# EAGLE design carduino-board (EAGLE 6.1)
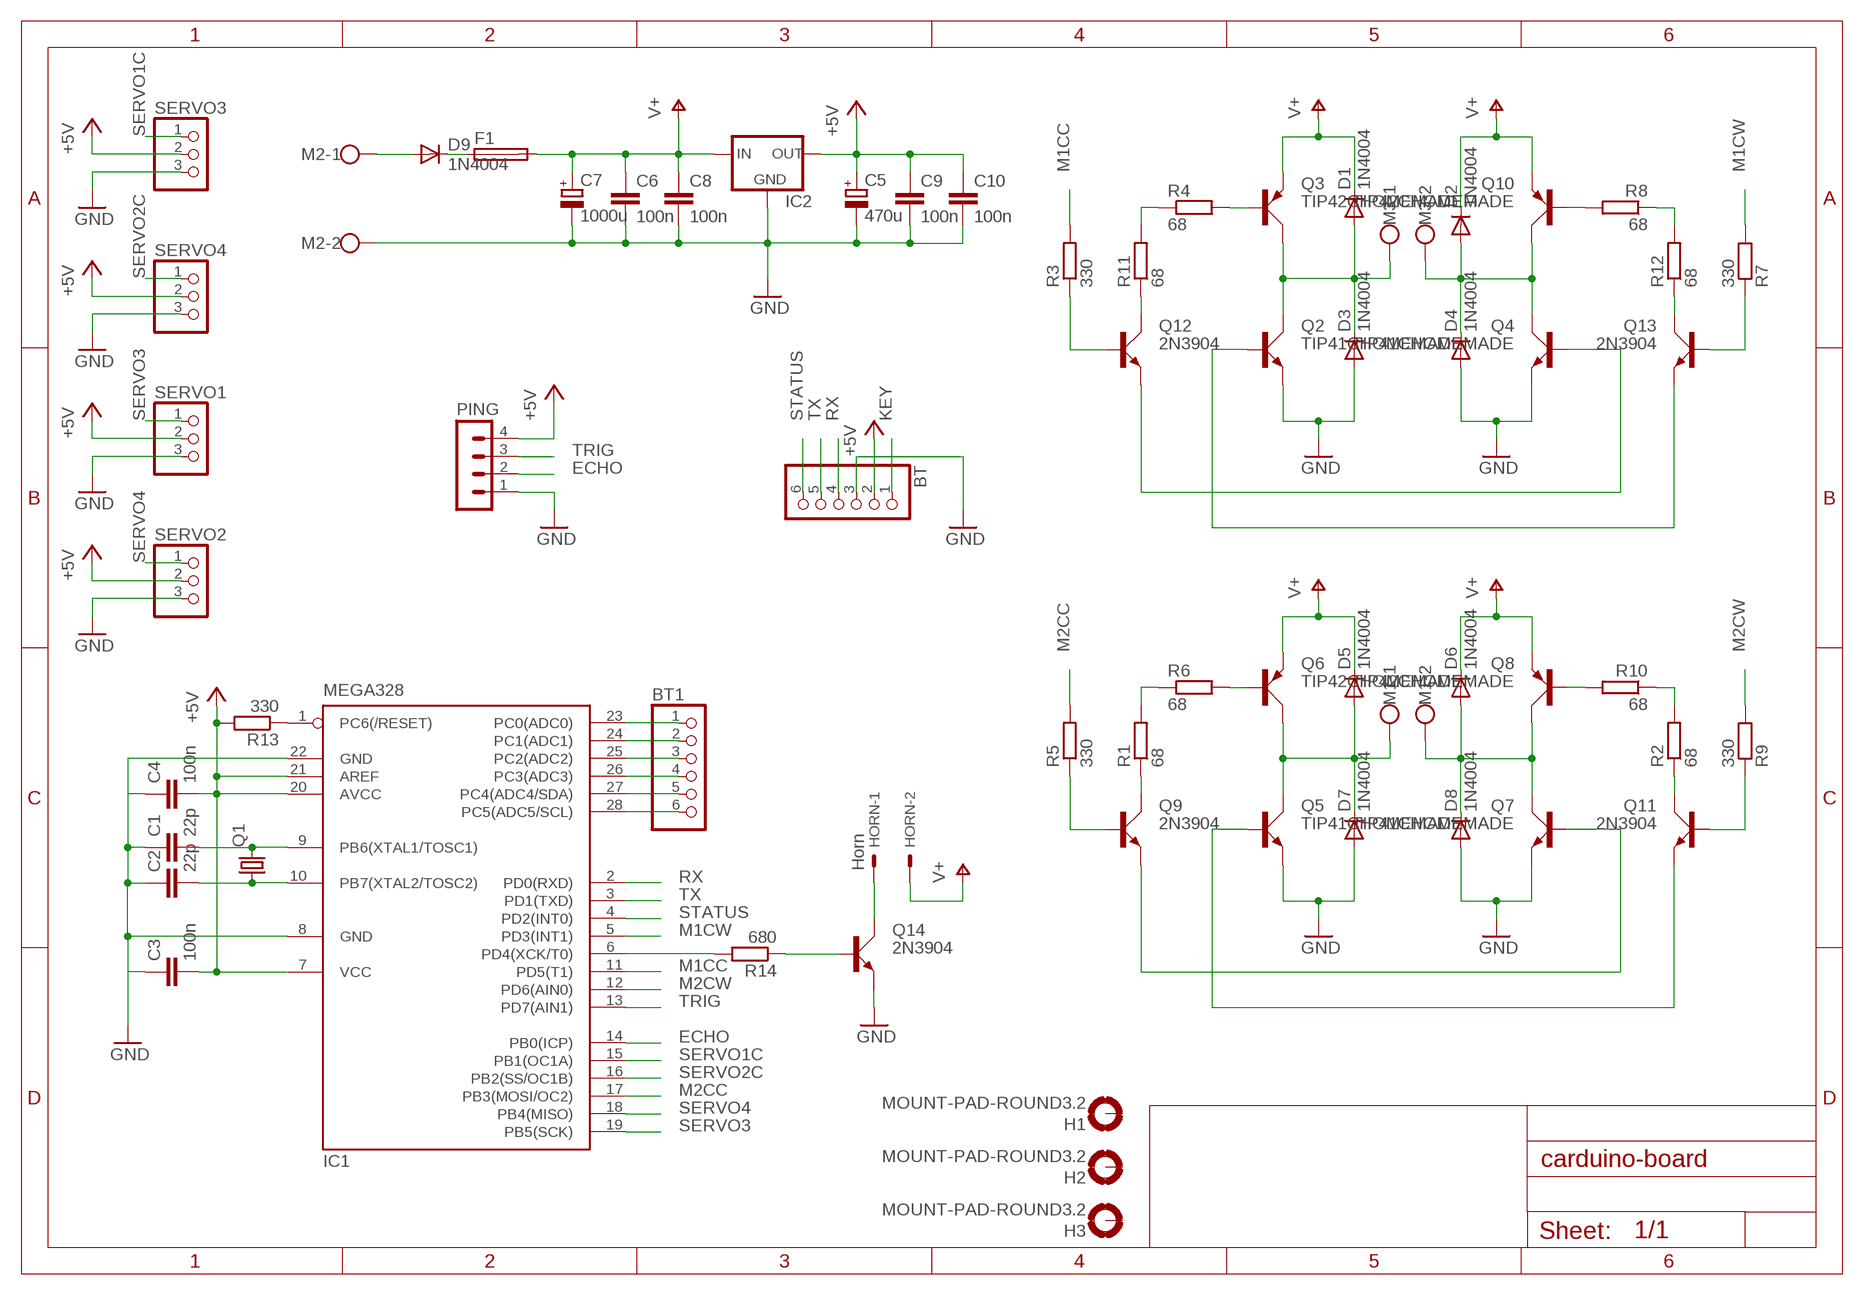
[diagram p0: schematic, sheet 1]

## Parts
BT  PINHD-1X6HOMEMADE  [1X06-HOMEMADE]
BT1  PINHD-1X6HOMEMADE  [1X06-HOMEMADE]
C1  22p  C-EUC1206K  [C1206K]
C2  22p  C-EUC1206K  [C1206K]
C3  100n  C-EUC1206K  [C1206K]
C4  100n  C-EUC1206K  [C1206K]
C5  470u  CPOL-EUUD-8X10  [UD-8X10_NICHICON]
C6  100n  C-EUC1206K  [C1206K]
C7  1000u  CPOL-EUE3.5-10  [E3,5-10]
C8  100n  C-EUC1206K  [C1206K]
C9  100n  C-EUC1206K  [C1206K]
C10  100n  C-EUC1206K  [C1206K]
D1  1N4004  [DO41-10]
D2  1N4004  [DO41-10]
D3  1N4004  [DO41-10]
D4  1N4004  [DO41-10]
D5  1N4004  [DO41-10]
D6  1N4004  [DO41-10]
D7  1N4004  [DO41-10]
D8  1N4004  [DO41-10]
D9  1N4004  [DO41-10]
F1  TE5  [TE5]
H1  MOUNT-PAD-ROUND3.2  [3,2-PAD]
H2  MOUNT-PAD-ROUND3.2  [3,2-PAD]
H3  MOUNT-PAD-ROUND3.2  [3,2-PAD]
HORN  Horn  22-23-2021  [22-23-2021]
IC1  MEGA328  MEGA8-P  [DIL28-3]
IC2  78XXS  [78XXS]
M1  W237-102  [W237-102]
M2  W237-102  [W237-102]
M3  W237-102  [W237-102]
PING  MA04-1HOMEMADE  [MA04-1-HOMEMADE]
Q1  CRYSTALHC49S  [HC49/S]
Q2  TIP41CHOMEMADE  [TO220AV-HOMEMADE]
Q3  TIP42CHOMEMADE  [TO220AV-HOMEMADE]
Q4  TIP41CHOMEMADE  [TO220AV-HOMEMADE]
Q5  TIP41CHOMEMADE  [TO220AV-HOMEMADE]
Q6  TIP42CHOMEMADE  [TO220AV-HOMEMADE]
Q7  TIP41CHOMEMADE  [TO220AV-HOMEMADE]
Q8  TIP42CHOMEMADE  [TO220AV-HOMEMADE]
Q9  2N3904  [TO92D]
Q10  TIP42CHOMEMADE  [TO220AV-HOMEMADE]
Q11  2N3904  [TO92D]
Q12  2N3904  [TO92D]
Q13  2N3904  [TO92D]
Q14  2N3904  [TO92D]
R1  68  R-EU_M1206  [M1206]
R2  68  R-EU_M1206  [M1206]
R3  330  R-EU_M1206  [M1206]
R4  68  R-EU_M1206  [M1206]
R5  330  R-EU_M1206  [M1206]
R6  68  R-EU_M1206  [M1206]
R7  330  R-EU_M1206  [M1206]
R8  68  R-EU_M1206  [M1206]
R9  330  R-EU_M1206  [M1206]
R10  68  R-EU_M1206  [M1206]
R11  68  R-EU_M1206  [M1206]
R12  68  R-EU_M1206  [M1206]
R13  330  R-EU_M1206  [M1206]
R14  680  R-EU_M1206  [M1206]
SERVO1  PINHD-1X3HOMEMADE  [1X03-HOMEMADE]
SERVO2  PINHD-1X3HOMEMADE  [1X03-HOMEMADE]
SERVO3  PINHD-1X3HOMEMADE  [1X03-HOMEMADE]
SERVO4  PINHD-1X3HOMEMADE  [1X03-HOMEMADE]

## Nets
+5V: BT.2 C3.2 C4.2 C5.+ C9.1 C10.1 IC1.7(VCC) IC1.20(AVCC) IC1.21(AREF) IC2.OUT PING.4 R13.2 SERVO1.2 SERVO2.2 SERVO3.2 SERVO4.2
ECHO: IC1.14(PB0(ICP)) PING.2
GND: BT.3 C1.1 C2.1 C3.1 C4.1 C5.- C6.2 C7.- C8.2 C9.2 C10.2 D3.A D4.A D7.A D8.A IC1.8(GND) IC1.22(GND) IC2.GND M2.2 PING.1 Q2.E Q4.E Q5.E Q7.E Q14.E SERVO1.3 SERVO2.3 SERVO3.3 SERVO4.3
KEY: BT.1
M1CC: IC1.11(PD5(T1)) R3.2
M1CW: IC1.5(PD3(INT1)) R7.2
M2CC: IC1.17(PB3(MOSI/OC2)) R5.2
M2CW: IC1.12(PD6(AIN0)) R9.2
N$1: D6.A D8.C M1.2 Q7.C Q8.C
N$2: D5.A D7.C M1.1 Q5.C Q6.C
N$3: Q9.C R1.1
N$4: Q11.C R2.1
N$5: R1.2 R6.1
N$6: R2.2 R10.1
N$7: C1.2 IC1.9(PB6(XTAL1/TOSC1)) Q1.2
N$8: C2.2 IC1.10(PB7(XTAL2/TOSC2)) Q1.1
N$9: Q6.B R6.2
N$10: Q11.B R9.1
N$11: Q7.B Q9.E
N$12: D2.A D4.C M3.2 Q4.C Q10.C
N$13: Q8.B R10.2
N$14: Q5.B Q11.E
N$15: Q9.B R5.1
N$16: D1.A D3.C M3.1 Q2.C Q3.C
N$17: R4.1 R11.2
N$18: Q3.B R4.2
N$19: R8.1 R12.2
N$20: Q10.B R8.2
N$21: Q13.B R7.1
N$22: Q4.B Q12.E
N$23: Q2.B Q13.E
N$24: Q12.B R3.1
N$25: Q12.C R11.1
N$26: Q13.C R12.1
N$27: D9.A M2.1
N$28: D9.C F1.1
N$29: IC1.1(PC6(/RESET)) R13.1
N$30: HORN.1 Q14.C
N$37: Q14.B R14.1
N$38: IC1.6(PD4(XCK/T0)) R14.2
N$39: BT1.1 IC1.23(PC0(ADC0))
N$40: BT1.2 IC1.24(PC1(ADC1))
N$41: BT1.3 IC1.25(PC2(ADC2))
N$42: BT1.4 IC1.26(PC3(ADC3))
N$43: BT1.5 IC1.27(PC4(ADC4/SDA))
N$44: BT1.6 IC1.28(PC5(ADC5/SCL))
RX: BT.4 IC1.2(PD0(RXD))
SERVO1C: IC1.15(PB1(OC1A)) SERVO3.1
SERVO2C: IC1.16(PB2(SS/OC1B)) SERVO4.1
SERVO3: IC1.19(PB5(SCK)) SERVO1.1
SERVO4: IC1.18(PB4(MISO)) SERVO2.1
STATUS: BT.6 IC1.4(PD2(INT0))
TRIG: IC1.13(PD7(AIN1)) PING.3
TX: BT.5 IC1.3(PD1(TXD))
V+: C6.1 C7.+ C8.1 D1.C D2.C D5.C D6.C F1.2 HORN.2 IC2.IN Q3.E Q6.E Q8.E Q10.E
Unconnected: H1.B3,2(MOUNT) H2.B3,2(MOUNT) H3.B3,2(MOUNT)

## Library data of the parts
BT BT1 = adafruit:PINHD-1X6: PIN HEADER
C1-C4 C6 C8-C10 = rcl:C-EU: CAPACITOR, European symbol
C5 C7 = rcl:CPOL-EU: POLARIZED CAPACITOR, European symbol
D1-D9 = adafruit:1N4004: DIODE General purpose 1N400x type rectifier (With bigger pads) http://www.ladyada.net/library/pcb/eaglelibrary.html
F1 = fuse:TE5: FUSE Wickmann; OC_FARNELL: unknown; OC_NEWARK: unknown
H1-H3 = holes:MOUNT-PAD-ROUND: MOUNTING PAD, round
HORN = con-molex:22-23-2021: .100" (2.54mm) Center Header - 2 Pin; MF: MOLEX; MPN: 22-23-2021; OC_FARNELL: 1462926; OC_NEWARK: 25C3832
IC1 = atmel:MEGA8-P: MICROCONTROLLER 8 Kbytes FLASH, 1 kbytes SRAM, 512 bytes EEPROM, USART, 4-channel 10 bit ADC, 2-channel 8 bit ADC Pin compatible with Atmega48, ATMega88, ATMega168 Source: avr.lbr; OC_FARNELL: unknown; OC_NEWARK: unknown
IC2 = v-reg:78XXS: VOLTAGE REGULATOR
M1-M3 = con-wago-500:W237-102: WAGO SCREW CLAMP; MPN: 237-102; OC_FARNELL: unknown; OC_NEWARK: 70K9898
PING = con-lstb:MA04-1: PIN HEADER
Q1 = crystal:CRYSTAL: CRYSTAL; OC_FARNELL: 1667008; OC_NEWARK: unknown
Q2 Q4 Q5 Q7 = transistor-power:TIP41C: NPN TRANSISTOR
Q3 Q6 Q8 Q10 = transistor-power:TIP42C: PNP TRANSISTOR
Q9 Q11-Q14 = transistor-small-signal:2N3904: NPN TRANSISTOR
R1-R14 = rcl:R-EU_: RESISTOR, European symbol
SERVO1-SERVO4 = adafruit:PINHD-1X3: PIN HEADER

## Board
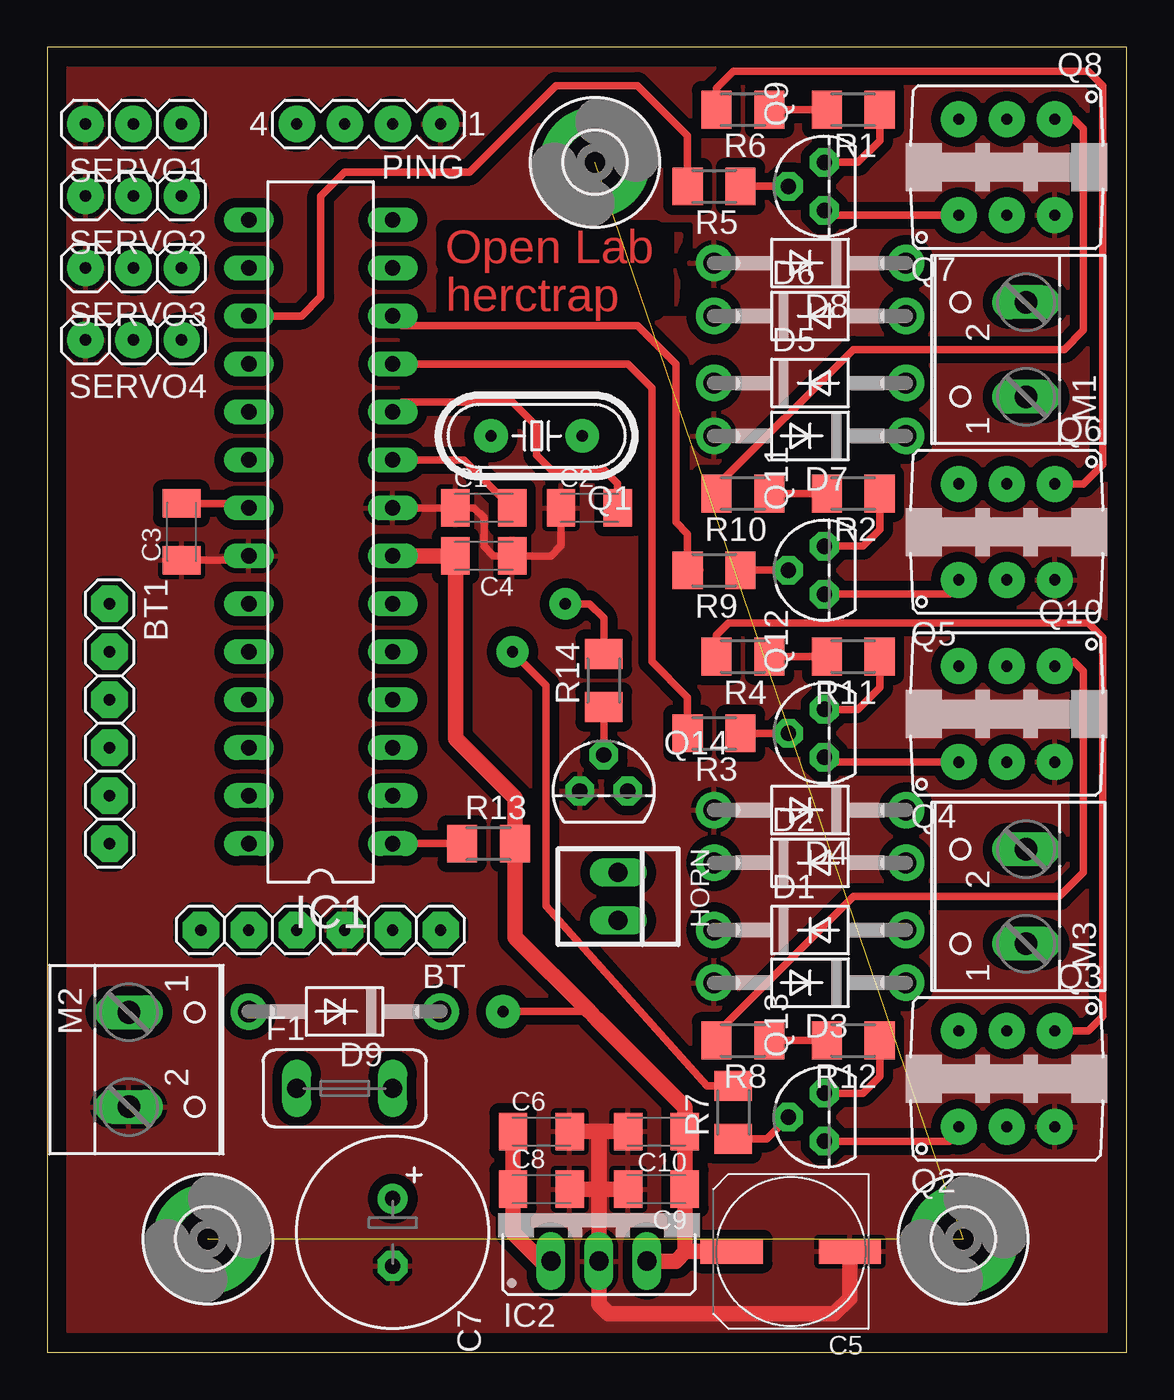
[diagram p1: board, top side]
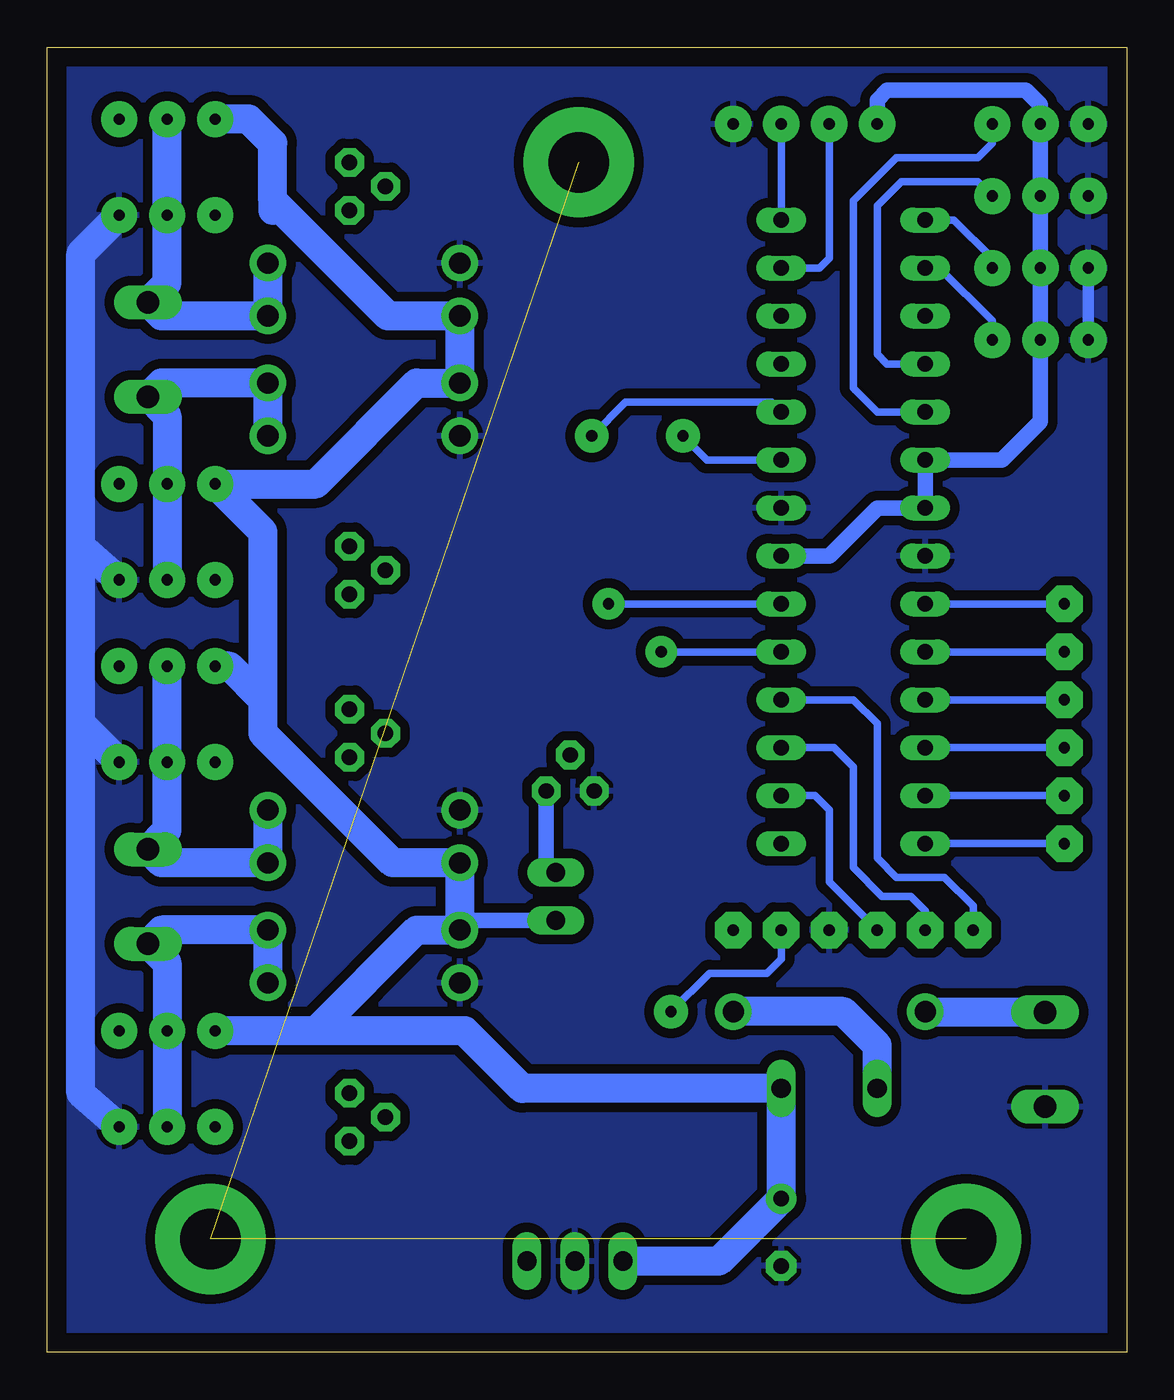
[diagram p2: board, bottom side, seen from below]

Size 57.15 x 69.09 mm. Coordinates in mm from the lower left corner, seen from the top.
Outline: 0,0 57.15,0 57.15,69.09 0,69.09 0,0
Copper layers (1*16): Top 0.035mm / dielectric 1.5mm / Bottom 0.035mm
Design rules "default": minimum track width 10mil, minimum drill 24mil, track to track 8mil, track to pad 8mil, pad to pad 8mil, via to via 8mil, smd to smd 8mil, copper to edge 40mil, drill to drill 8mil, minimum pad ring 10mil, minimum via ring 8mil, stop-mask expansion 4mil, vias tented up to drill 0mil, thermal gap 10mil

### Footprints (pad centres in the part's own frame; a part is rotated, then mirrored left to right if it is on the bottom)
1X06-HOMEMADE = drill 0.6 pad 1.93 octagon: 1 -6.35,0; 2 -3.81,0; 3 -1.27,0; 4 1.27,0; 5 3.81,0; 6 6.35,0
C1206K = smd 1.5 x 2: 1 -1.5,0; 2 1.5,0
UD-8X10_NICHICON = smd 3.3 x 1.3: + 3.125,0; - -3.125,0
E3,5-10 = drill 0.813 pad 1.6 round: + -1.778,0 | drill 0.813 pad 1.6 octagon: - 1.778,0
DO41-10 = drill 1.118 pad 1.93 round: A 5.08,0; C -5.08,0
TE5 = drill 1.016 long: 1 -2.54,0; 2 2.54,0
3,2-PAD = drill 3.2 pad 5.842 round: B3,2 0,0
22-23-2021 = drill 1 long: 1 -1.27,0; 2 1.27,0
DIL28-3 = drill 0.813 long: 1 -16.51,-3.81; 2 -13.97,-3.81; 3 -11.43,-3.81; 4 -8.89,-3.81; 5 -6.35,-3.81; 6 -3.81,-3.81; 7 -1.27,-3.81; 8 1.27,-3.81; 9 3.81,-3.81; 10 6.35,-3.81; 11 8.89,-3.81; 12 11.43,-3.81; 13 13.97,-3.81; 14 16.51,-3.81; 15 16.51,3.81; 16 13.97,3.81; 17 11.43,3.81; 18 8.89,3.81; 19 6.35,3.81; 20 3.81,3.81; 21 1.27,3.81; 22 -1.27,3.81; 23 -3.81,3.81; 24 -6.35,3.81; 25 -8.89,3.81; 26 -11.43,3.81; 27 -13.97,3.81; 28 -16.51,3.81
78XXS = drill 1.016 long: GND 0,-2.54; IN -2.54,-2.54; OUT 2.54,-2.54
W237-102 = drill 1.194 long: 1 -2.5,-1.27; 2 2.5,-1.27
MA04-1-HOMEMADE = drill 0.6 pad 1.93 round: 1 -3.81,0; 2 -1.27,0; 3 1.27,0; 4 3.81,0
HC49/S = drill 0.6 pad 1.778 round: 1 -2.413,0; 2 2.413,0
TO220AV-HOMEMADE = drill 0.6 pad 1.905 round: B -2.54,-2.54; C 0,-2.54; E 2.54,-2.54
TO92D = drill 0.813 pad 1.524 octagon: B 0,1.905; C 1.27,0; E -1.27,0
M1206 = smd 1.6 x 2: 1 -1.4,0; 2 1.4,0
1X03-HOMEMADE = drill 0.6 pad 1.905 round: 1 -2.54,0 | drill 0.6 pad 1.93 round: 2 0,0; 3 2.54,0

### Placement (x,y rotation side)
BT  14.48,22.35 180 top
BT1  3.3,33.27 270 top
C1  23.11,44.7 0 top
C2  28.7,44.7 0 top
C3  7.11,43.43 90 top
C4  23.11,42.16 180 top
C5  39.37,5.33 180 top
C6  26.16,11.68 0 top
C7  18.29,6.35 270 top
C8  26.16,8.64 0 top
C9  32.26,8.64 180 top
C10  32.26,11.68 180 top
D1  40.39,22.35 0 top
D2  40.39,25.91 0 top
D3  40.39,19.56 180 top
D4  40.39,28.7 180 top
D5  40.39,51.31 0 top
D6  40.39,54.86 0 top
D7  40.39,48.51 180 top
D8  40.39,57.66 180 top
D9  15.75,18.03 180 top
F1  15.75,13.97 0 top
H1  8.5,6 0 top
H2  48.5,6 0 top
H3  29,63 0 top
HORN  30.23,24.13 270 top
IC1  14.48,43.43 90 top
IC2  29.21,7.37 0 top
M1  50.55,53.09 90 top
M2  5.59,15.49 270 top
M3  50.55,24.13 90 top
PING  17.02,65.02 180 top
Q1  25.91,48.51 180 top
Q2  50.8,14.48 0 top
Q3  50.8,14.48 180 top
Q4  50.8,33.78 0 top
Q5  50.8,43.43 0 top
Q6  50.8,43.43 180 top
Q7  50.8,62.74 0 top
Q8  50.8,62.74 180 top
Q9  41.15,61.72 90 top
Q10  50.8,33.78 180 top
Q11  41.15,41.4 90 top
Q12  41.15,32.77 90 top
Q13  41.15,12.45 90 top
Q14  29.46,29.72 0 top
R1  42.67,65.79 180 top
R2  42.67,45.47 180 top
R3  35.31,32.77 180 top
R4  36.83,36.83 180 top
R5  35.31,61.72 180 top
R6  36.83,65.79 180 top
R7  36.32,12.7 90 top
R8  36.83,16.51 180 top
R9  35.31,41.4 180 top
R10  36.83,45.47 180 top
R11  42.67,36.83 180 top
R12  42.67,16.51 180 top
R13  23.37,26.92 0 top
R14  29.46,35.56 90 top
SERVO1  4.57,65.02 180 top
SERVO2  4.57,61.21 180 top
SERVO3  4.57,57.4 180 top
SERVO4  4.57,53.59 180 top

### Tracks (layer width: path | path; a pad name or v marks a point on that pad's centre or on a via)
+5V  (via drill 0.6 pad 1.78)
  Top 0.406: C3.2 10.44,44.93 IC1.21 | 28.7,18.03 v24.13,18.03
  Top 0.813: IC1.7 C4.2 21.61,32.49 24.77,29.33 R13.2 24.77,21.97 28.7,18.03 29.08,17.65 33.76,12.98 C10.1 C9.1 33.76,5.36 33.78,5.33 | IC2.OUT 33.27,4.83 33.78,5.33 | 33.78,5.33 C5.+
  Bottom 0.406: v24.13,18.03 22.1,20.07 19.05,20.07 18.29,20.83 BT.2
  Bottom 0.813: IC1.7 15.75,42.16 13.21,44.7 IC1.21 IC1.20 6.6,47.24 4.57,49.28 SERVO4.2 SERVO3.2 SERVO2.2 SERVO1.2 4.57,66.04 5.33,66.8 12.7,66.8 13.21,66.29 PING.4
ECHO
  Bottom 0.406: IC1.14 PING.2
GND
  Top 0.406: IC1.8 C1.1 22.61,44.7 23.11,44.2 23.11,42.67 23.62,42.16 C4.1 26.67,42.16 27.2,42.7 C2.1 | C3.1 10.44,41.93 IC1.22
  Top 0.813: 29.21,11.68 C6.2 | 29.21,11.68 C10.2 | 29.21,8.64 IC2.GND 29.21,2.54 29.72,2.03 41.66,2.03 42.49,2.87 C5.- | 29.21,8.64 29.21,11.68 | 29.21,8.64 C8.2 | 29.21,8.64 C9.2
  Bottom 0.61: SERVO4.3 SERVO3.3
  Bottom 1.524: 55.37,42.67 Q5.E | 55.37,42.67 55.37,58.17 Q7.E | Q2.E 55.37,13.72 55.37,33.27 | 55.37,33.27 55.37,42.67 | 55.37,33.27 Q4.E
  pour Bottom (isolate 0.508): 0,69.09 0,0 57.15,0 57.15,69.09
  pour Top (isolate 0.508, rank 2): 0,69.09 57.15,69.09 57.15,0 0,0
M1CC
  Top 0.406: IC1.11 30.73,52.32 32,51.05 32,36.58 33.91,34.67 R3.2
M1CW  (via drill 0.6 pad 1.68)
  Top 0.406: R7.2 34.92,14.1 26.42,23.62 26.42,35.31 v24.64,37.08
  Bottom 0.406: v24.64,37.08 IC1.5
M2CC
  Top 0.406: R5.2 33.91,64.39 31.24,67.06 26.92,67.06 22.35,62.48 15.75,62.48 14.48,61.21 14.48,55.88 13.46,54.86 IC1.17
M2CW
  Top 0.406: 34.54,41.4 R9.2 33.91,43.31 33.27,43.94 33.27,52.32 31.24,54.36 18.8,54.36 IC1.12
N$1
  Bottom 1.524: Q8.C Q7.C 50.8,56.6 M1.2 51.09,54.86 D6.A D8.C
N$2
  Bottom 1.524: Q5.C Q6.C 50.8,49.57 M1.1 51.09,51.31 D5.A D7.C
N$3
  Top 0.406: Q9.C 42.93,62.99 44.07,64.14 R1.1
N$4
  Top 0.406: Q11.C 43.18,42.67 44.07,43.56 R2.1
N$5
  Top 0.406: R6.1 R1.2
N$6
  Top 0.406: R10.1 R2.2
N$7
  Top 0.406: C1.2 22.07,47.24 IC1.9
  Bottom 0.406: IC1.9 22.23,47.24 Q1.2
N$8
  Top 0.406: IC1.10 18.8,50.29 24.64,50.29 25.91,49.02 25.91,47.5 26.67,46.74 29.46,46.74 30.2,46 C2.2
  Bottom 0.406: Q1.1 26.54,50.29 18.8,50.29 IC1.10
N$9
  Top 0.406: Q6.B 54.86,45.97 55.88,46.99 55.88,67.06 55.12,67.82 36.32,67.82 35.43,66.93 R6.2
N$10
  Top 0.406: R9.1 Q11.B
N$11
  Top 0.406: Q9.E 41.4,60.2 Q7.B
N$12
  Bottom 1.524: Q10.C Q4.C 50.8,27.65 M3.2 51.09,25.91 D2.A D4.C
N$13
  Top 0.406: R10.2 35.43,45.84 42.67,53.09 53.85,53.09 54.86,54.1 54.86,64.77 54.36,65.28 Q8.B
N$14
  Top 0.406: Q11.E 47.75,40.13 Q5.B
N$15
  Top 0.406: R5.1 Q9.B
N$16
  Bottom 1.524: Q2.C Q3.C 50.8,20.61 M3.1 51.09,22.35 D1.A D3.C
N$17
  Top 0.406: R4.1 R11.2
N$18
  Top 0.406: Q3.B 55.12,17.02 55.88,17.78 55.88,37.85 55.12,38.61 36.07,38.61 35.43,37.97 R4.2
N$19
  Top 0.406: R8.1 R12.2
N$20
  Top 0.406: Q10.B 54.36,36.58 54.86,36.07 54.86,25.4 53.59,24.13 42.67,24.13 35.43,16.89 R8.2
N$21
  Top 0.406: R7.1 38.1,11.3 Q13.B
N$22
  Top 0.406: Q12.E 41.4,31.24 Q4.B
N$23
  Top 0.406: Q13.E 47.75,11.18 Q2.B
N$24
  Top 0.406: R3.1 Q12.B
N$25
  Top 0.406: Q12.C 42.93,34.04 44.07,35.18 R11.1
N$26
  Top 0.406: Q13.C 43.18,13.72 44.07,14.61 R12.1
N$27
  Bottom 1.524: M2.1 10.67,17.99 D9.A
N$28
  Bottom 1.524: D9.C 14.99,18.03 13.21,16.26 F1.1
N$29
  Top 0.406: IC1.1 R13.1
N$30
  Bottom 0.813: Q14.C 30.73,25.91 HORN.1
N$37
  Top 0.406: Q14.B R14.1
N$38  (via drill 0.6 pad 1.68)
  Top 0.406: R14.2 29.46,38.86 28.7,39.62 v27.43,39.62
  Bottom 0.406: IC1.6 v27.43,39.62
N$39
  Bottom 0.406: BT1.1 IC1.23
N$40
  Bottom 0.406: BT1.2 IC1.24
N$41
  Bottom 0.406: BT1.3 IC1.25
N$42
  Bottom 0.406: BT1.4 IC1.26
N$43
  Bottom 0.406: BT1.5 IC1.27
N$44
  Bottom 0.406: BT1.6 IC1.28
N$45  (via drill 0.6 pad 1.91)  (2 unrouted)
  other vias: 8.5,6 48.5,6 29,63
N$555
  pour Top (isolate 1.016): 21.08,59.18 33.53,59.18 33.27,55.12 21.34,55.12
RX
  Bottom 0.406: BT.4 15.75,24.89 15.75,28.7 16.51,29.46 IC1.2
SERVO1C
  Bottom 0.406: SERVO3.1 7.11,57.91 9.14,59.94 IC1.15
SERVO2C
  Bottom 0.406: SERVO4.1 7.11,54.61 9.91,57.4 IC1.16
SERVO3
  Bottom 0.406: IC1.19 13.21,49.78 14.48,51.05 14.48,60.96 12.19,63.25 7.87,63.25 7.11,64.01 SERVO1.1
SERVO4
  Bottom 0.406: IC1.18 12.7,52.32 13.21,52.83 13.21,60.71 11.94,61.98 7.87,61.98 SERVO2.1
STATUS
  Bottom 0.406: IC1.4 14.48,34.54 13.21,33.27 13.21,26.16 12.19,25.15 9.65,25.15 8.13,23.62 BT.6
TRIG
  Bottom 0.406: PING.3 15.75,57.91 16.26,57.4 IC1.13
TX
  Bottom 0.406: BT.5 10.67,23.37 11.43,24.13 12.95,24.13 14.48,25.65 14.48,30.99 15.49,32 IC1.3
V+
  Top 0.813: C6.1 C8.1 24.66,6.33 26.16,4.83 IC2.IN
  Bottom 0.813: HORN.2 35.05,22.86 D1.C
  Bottom 1.524: 42.93,17.02 35.05,17.02 32,13.97 F1.2 C7.+ 21.59,4.83 IC2.IN | 45.72,34.54 45.72,32.77 38.86,25.91 D2.C D1.C 37.59,22.35 42.93,17.02 | 45.72,34.54 47.5,36.32 Q10.E | 45.72,34.54 45.72,43.43 Q6.E 42.93,45.97 37.59,51.31 D5.C D6.C 39.12,54.86 45.21,60.96 | 45.21,60.96 45.21,60.45 | 45.21,60.96 45.21,64.01 46.48,65.28 Q8.E | 42.93,17.02 Q3.E

### Text on the board
Top: Open Lab | herctrap